# EAGLE schematic controller_relays (EAGLE 8.3.2)
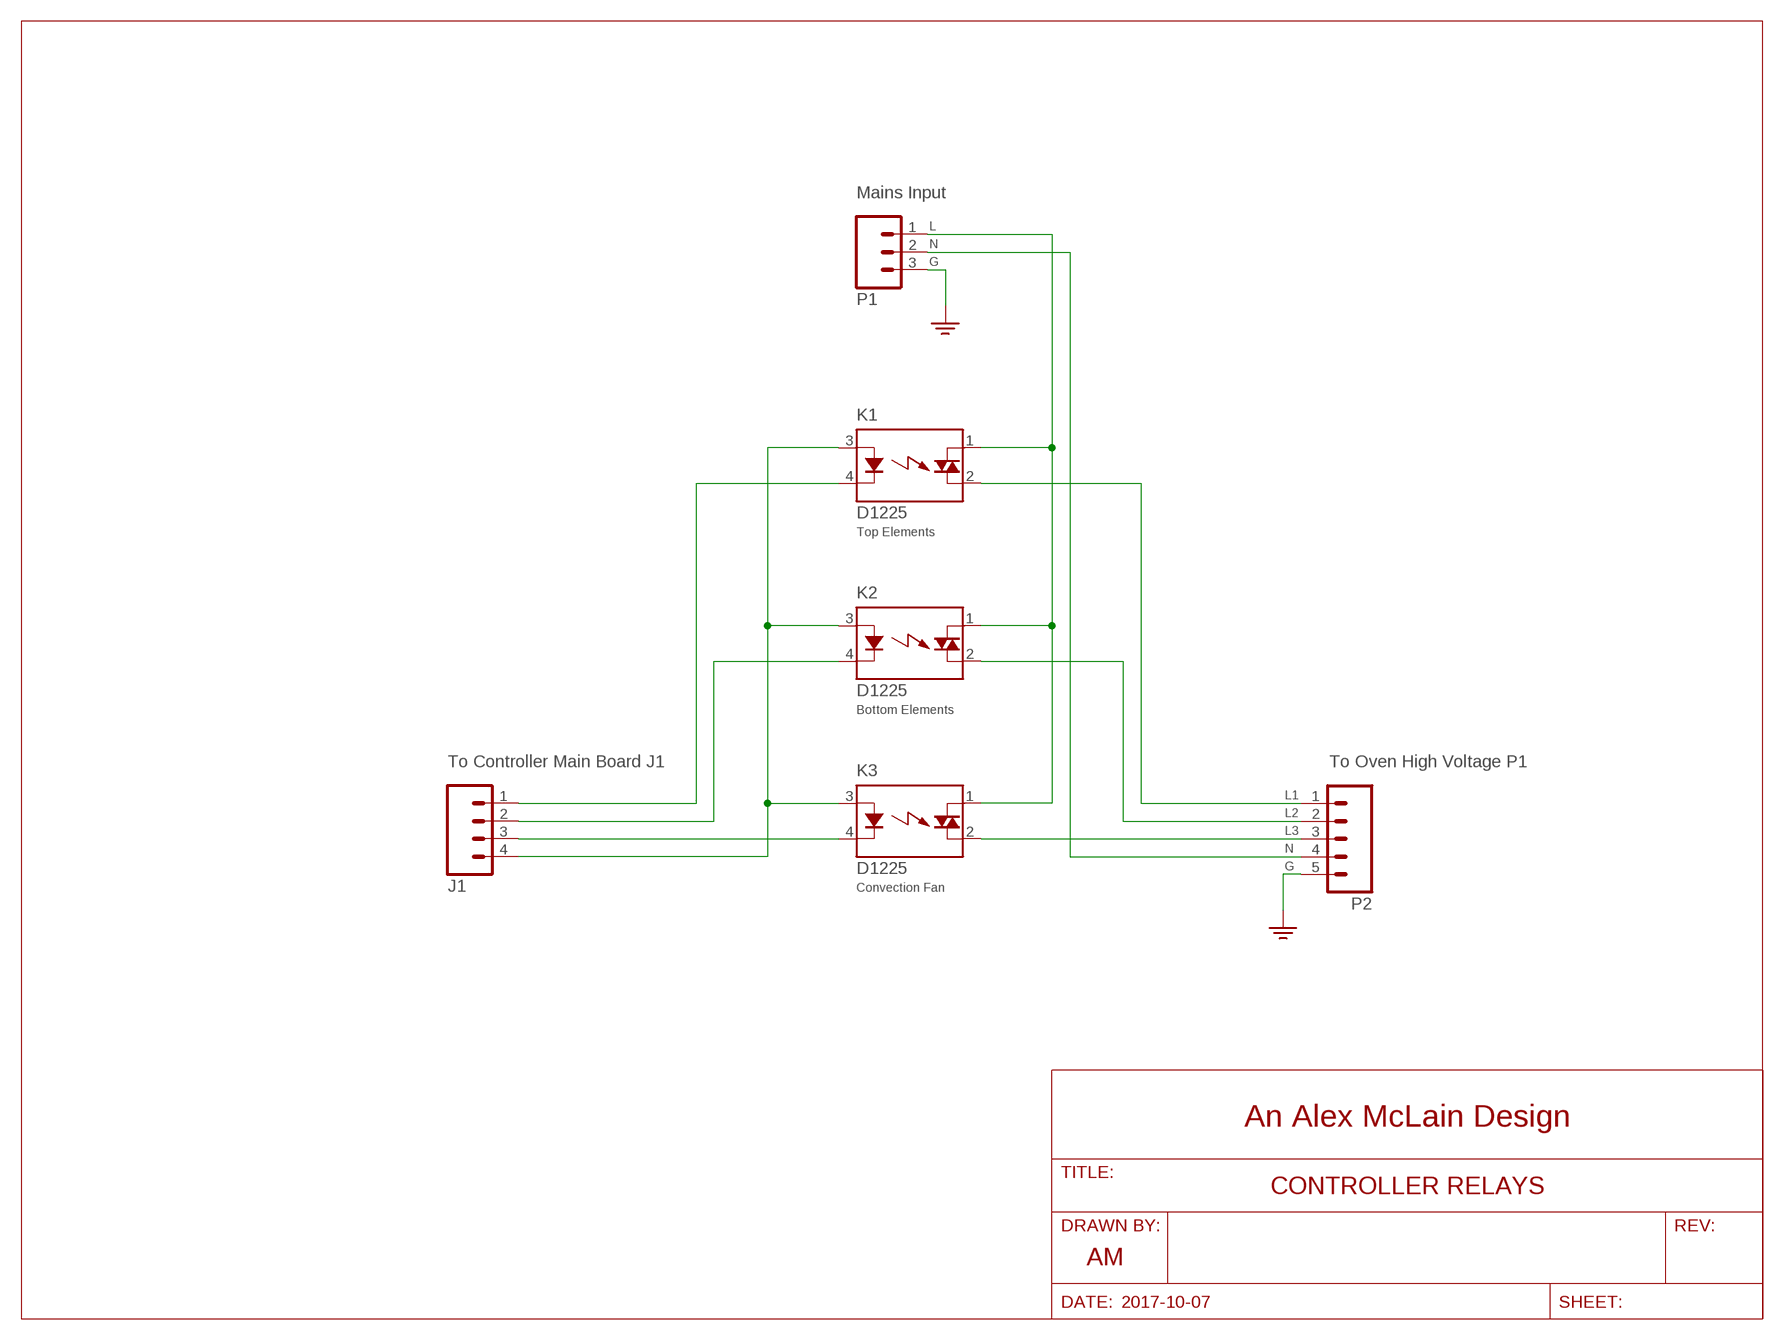
[diagram p0: schematic, sheet 1]
FRAME1 (LETTER_L): COMPANY_NAME: An Alex McLain Design; DATE_DRAWN: 2017-10-07; DRAWN_BY: AM; TITLE: CONTROLLER RELAYS

## Parts
J1  MA04  [04PA]
K1  D1225  AQ2A2-J-ZP3  [AQ1-FLAT]
K2  D1225  AQ2A2-J-ZP3  [AQ1-FLAT]
K3  D1225  AQ2A2-J-ZP3  [AQ1-FLAT]
P1  MA03  [03P]
P2  MA05  [05PA]

## Nets
GND: P1.3 P2.5 ; supply symbol labelled EGND
N$1: J1.4 K1.3(A) K2.3(A) K3.3(A)
N$2: J1.3 K3.4(K)
N$3: J1.2 K2.4(K)
N$4: J1.1 K1.4(K)
N$5: K1.1(DS1) K2.1(DS1) K3.1(DS1) P1.1
N$6: K1.2(DS2) P2.1
N$7: K2.2(DS2) P2.2
N$8: K3.2(DS2) P2.3
N$9: P1.2 P2.4

## Notes on the sheet
- Mains Input
- L
- N
- G
- Top Elements
- Bottom Elements
- To Controller Main Board J1 | To Oven High Voltage P1
- L1
- L2
- L3
- N
- G
- Convection Fan

## Library data of the parts
J1 = con-amp-quick:MA04: AMP QUICK CONNECTOR; OC_FARNELL: unknown; OC_NEWARK: unknown
K1-K3 = relay:AQ?: SOLID STATE RELAY NAiS Source: http://www.mew-europe.com/.. en_ds_61601_0000.pdf; MPN: AQ2A2-ZP3/28VDC; OC_FARNELL: 1163552; OC_NEWARK: 13P1232
P1 = con-amp-quick:MA03: AMP QUICK CONNECTOR; OC_FARNELL: unknown; OC_NEWARK: unknown
P2 = con-amp-quick:MA05: AMP QUICK CONNECTOR; OC_FARNELL: unknown; OC_NEWARK: unknown